# Altium project ESP32-HWE-Uno.PrjPcb
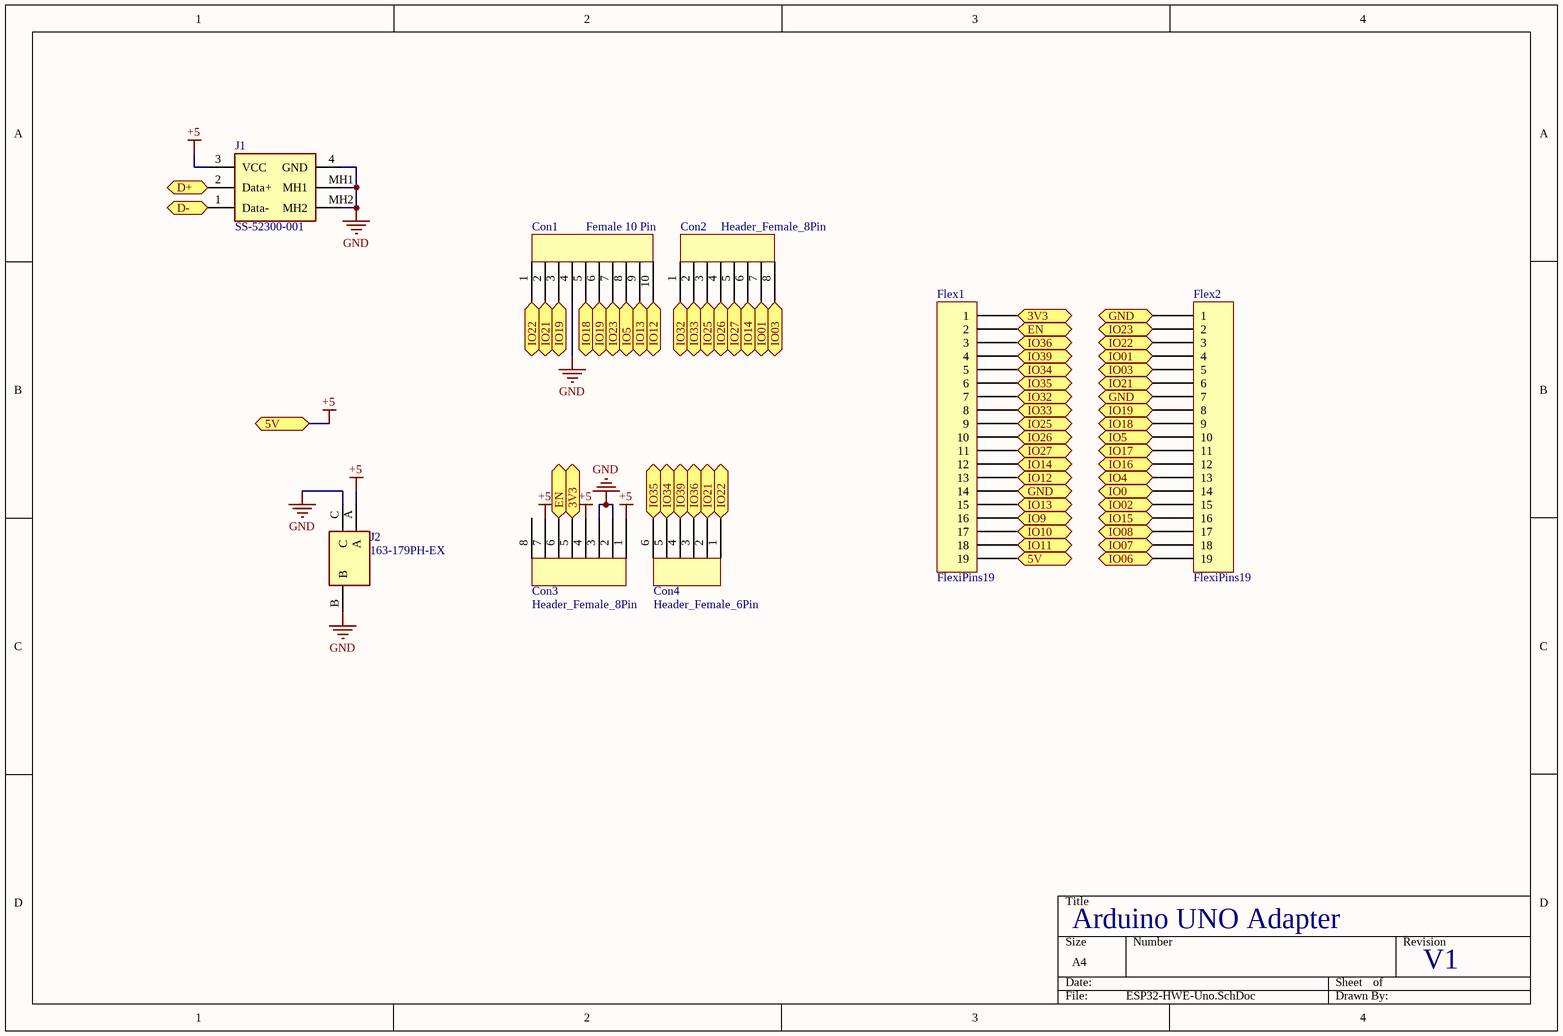
[diagram p0: ESP32-HWE-Uno.SchDoc]
1 sheet, 8 parts. Net scope: flat (ports and power ports of the same name join across sheets).
Board file: ESP32-HWE-Uno.PcbDoc

## Sheet ESP32-HWE-Uno.SchDoc
size A4; SheetNumber: 1; SheetTotal: 1

### Parts
Con1  Female 10 Pin  [Header_Female_10Pin]
Con2  Header_Female_8Pin  [Header_Female_8Pin]
Con3  Header_Female_8Pin  [Header_Female_8Pin]
Con4  Header_Female_6Pin  [Header_Female_6Pin]
Flex1  FlexiPins19  [FlexiPins19]
Flex2  FlexiPins19  [FlexiPins19]
J1  SS-52300-001  [SS52300001]
J2  163-179PH-EX  [163179PHEX]

### Ports
3V3 (bidir, see ESP32-HWE-Uno[2C]), 3V3 (bidir, see ESP32-HWE-Uno[3B]), 5V (bidir, see ESP32-HWE-Uno[1B]), 5V (bidir, see ESP32-HWE-Uno[3C]), D+ (bidir), D- (bidir), EN (bidir, see ESP32-HWE-Uno[2C]), EN (bidir, see ESP32-HWE-Uno[3B]), GND (bidir, see ESP32-HWE-Uno[3B]), IO0 (bidir), IO01 (bidir, see ESP32-HWE-Uno[2B]), IO01 (bidir, see ESP32-HWE-Uno[3B]), IO02 (bidir), IO03 (bidir, see ESP32-HWE-Uno[2B]), IO03 (bidir, see ESP32-HWE-Uno[3B]), IO4 (bidir), IO5 (bidir, see ESP32-HWE-Uno[2B]), IO5 (bidir, see ESP32-HWE-Uno[3B]), IO06 (bidir), IO07 (bidir), IO08 (bidir), IO9 (bidir), IO10 (bidir), IO11 (bidir), IO12 (bidir, see ESP32-HWE-Uno[2B]), IO12 (bidir, see ESP32-HWE-Uno[3B]), IO13 (bidir, see ESP32-HWE-Uno[2B]), IO13 (bidir, see ESP32-HWE-Uno[3B]), IO14 (bidir, see ESP32-HWE-Uno[2B]), IO14 (bidir, see ESP32-HWE-Uno[3B]), IO15 (bidir), IO16 (bidir), IO17 (bidir), IO18 (bidir, see ESP32-HWE-Uno[2B]), IO18 (bidir, see ESP32-HWE-Uno[3B]), IO19 (bidir, see ESP32-HWE-Uno[2B]), IO19 (bidir, see ESP32-HWE-Uno[2B], ESP32-HWE-Uno[3B]), IO21 (bidir, see ESP32-HWE-Uno[2B], ESP32-HWE-Uno[2C]), IO21 (bidir, see ESP32-HWE-Uno[2B], ESP32-HWE-Uno[3B]), IO21 (bidir, see ESP32-HWE-Uno[2C], ESP32-HWE-Uno[3B]), IO22 (bidir, see ESP32-HWE-Uno[2B], ESP32-HWE-Uno[2C]), IO22 (bidir, see ESP32-HWE-Uno[2B], ESP32-HWE-Uno[3B]), IO22 (bidir, see ESP32-HWE-Uno[2C], ESP32-HWE-Uno[3B]), IO23 (bidir, see ESP32-HWE-Uno[2B]), IO23 (bidir, see ESP32-HWE-Uno[3B]), IO25 (bidir, see ESP32-HWE-Uno[2B]), IO25 (bidir, see ESP32-HWE-Uno[3B]), IO26 (bidir, see ESP32-HWE-Uno[2B]), IO26 (bidir, see ESP32-HWE-Uno[3B]), IO27 (bidir, see ESP32-HWE-Uno[2B]), IO27 (bidir, see ESP32-HWE-Uno[3B]), IO32 (bidir, see ESP32-HWE-Uno[2B]), IO32 (bidir, see ESP32-HWE-Uno[3B]), IO33 (bidir, see ESP32-HWE-Uno[2B]), IO33 (bidir, see ESP32-HWE-Uno[3B]), IO34 (bidir, see ESP32-HWE-Uno[2C]), IO34 (bidir, see ESP32-HWE-Uno[3B]), IO35 (bidir, see ESP32-HWE-Uno[2C]), IO35 (bidir, see ESP32-HWE-Uno[3B]), IO36 (bidir, see ESP32-HWE-Uno[2C]), IO36 (bidir, see ESP32-HWE-Uno[3B]), IO39 (bidir, see ESP32-HWE-Uno[2C]), IO39 (bidir, see ESP32-HWE-Uno[3B])

### Nets
+5: Con3.1 Con3.4 Con3.7 Flex1.19 J1.3(VCC) J2.A ; port 5V
GND: Con1.4 Con3.2 Con3.3 J1.4(GND) J1.MH1 J1.MH2 J2.B J2.C
NetCon1_1: Con1.1 Con4.1 Flex2.3 ; port IO22
NetCon1_2: Con1.2 Con4.2 Flex2.6 ; port IO21
NetCon1_3: Con1.3 Con1.6 Flex2.8 ; port IO19
NetCon1_5: Con1.5 Flex2.9 ; port IO18
NetCon1_7: Con1.7 Flex2.2 ; port IO23
NetCon1_8: Con1.8 Flex2.10 ; port IO5
NetCon1_9: Con1.9 Flex1.15 ; port IO13
NetCon1_10: Con1.10 Flex1.13 ; port IO12
NetCon2_1: Con2.1 Flex1.7 ; port IO32
NetCon2_2: Con2.2 Flex1.8 ; port IO33
NetCon2_3: Con2.3 Flex1.9 ; port IO25
NetCon2_4: Con2.4 Flex1.10 ; port IO26
NetCon2_5: Con2.5 Flex1.11 ; port IO27
NetCon2_6: Con2.6 Flex1.12 ; port IO14
NetCon2_7: Con2.7 Flex2.4 ; port IO01
NetCon2_8: Con2.8 Flex2.5 ; port IO03
NetCon3_5: Con3.5 Flex1.1 ; port 3V3
NetCon3_6: Con3.6 Flex1.2 ; port EN
NetCon4_3: Con4.3 Flex1.3 ; port IO36
NetCon4_4: Con4.4 Flex1.4 ; port IO39
NetCon4_5: Con4.5 Flex1.5 ; port IO34
NetCon4_6: Con4.6 Flex1.6 ; port IO35
NetFlex1_14: Flex1.14 Flex2.1 Flex2.7 ; port GND
NetFlex1_16: Flex1.16 ; port IO9
NetFlex1_17: Flex1.17 ; port IO10
NetFlex1_18: Flex1.18 ; port IO11
NetFlex2_11: Flex2.11 ; port IO17
NetFlex2_12: Flex2.12 ; port IO16
NetFlex2_13: Flex2.13 ; port IO4
NetFlex2_14: Flex2.14 ; port IO0
NetFlex2_15: Flex2.15 ; port IO02
NetFlex2_16: Flex2.16 ; port IO15
NetFlex2_17: Flex2.17 ; port IO08
NetFlex2_18: Flex2.18 ; port IO07
NetFlex2_19: Flex2.19 ; port IO06
NetJ1_1: J1.1(Data-) ; port D-
NetJ1_2: J1.2(Data+) ; port D+

Not connected (* = marked no-connect by the designer): Con3 8

### Notes on the sheet
- Arduino UNO Adapter
- V1

### Library data of the parts
Con1 = Header_Female_10Pin
J1 = SS-52300-001: Connector; Manufacturer_Name: Bel; Description: USB Connectors USB 2.0 RA Receptacle Type B; Datasheet Link: https://belfuse.com/resources/datasheets/stewartconnector/ds-stw-usb-2.0-type-b-connectors.pdf; Height: 10.82mm; Manufacturer_Part_Number: SS-52300-001; Mouser Part Number: 530-SS-52300-001
J2 = 163-179PH-EX: Connector; Manufacturer_Name: Kobiconn; Datasheet Link: https://componentsearchengine.com/Datasheets/1/163-179PH-EX.pdf; Height: 11mm; Manufacturer_Part_Number: 163-179PH-EX; Mouser Part Number: 163-179PH-EX; Mouser Price/Stock: https://www.mouser.co.uk/ProductDetail/Kobiconn/163-179PH-EX?qs=Xb8IjHhkxj5l2UOaIqcGCw%3D%3D